# Altium schematic sheet Psoc-robot.SchDoc
size A4; SheetNumber: 4
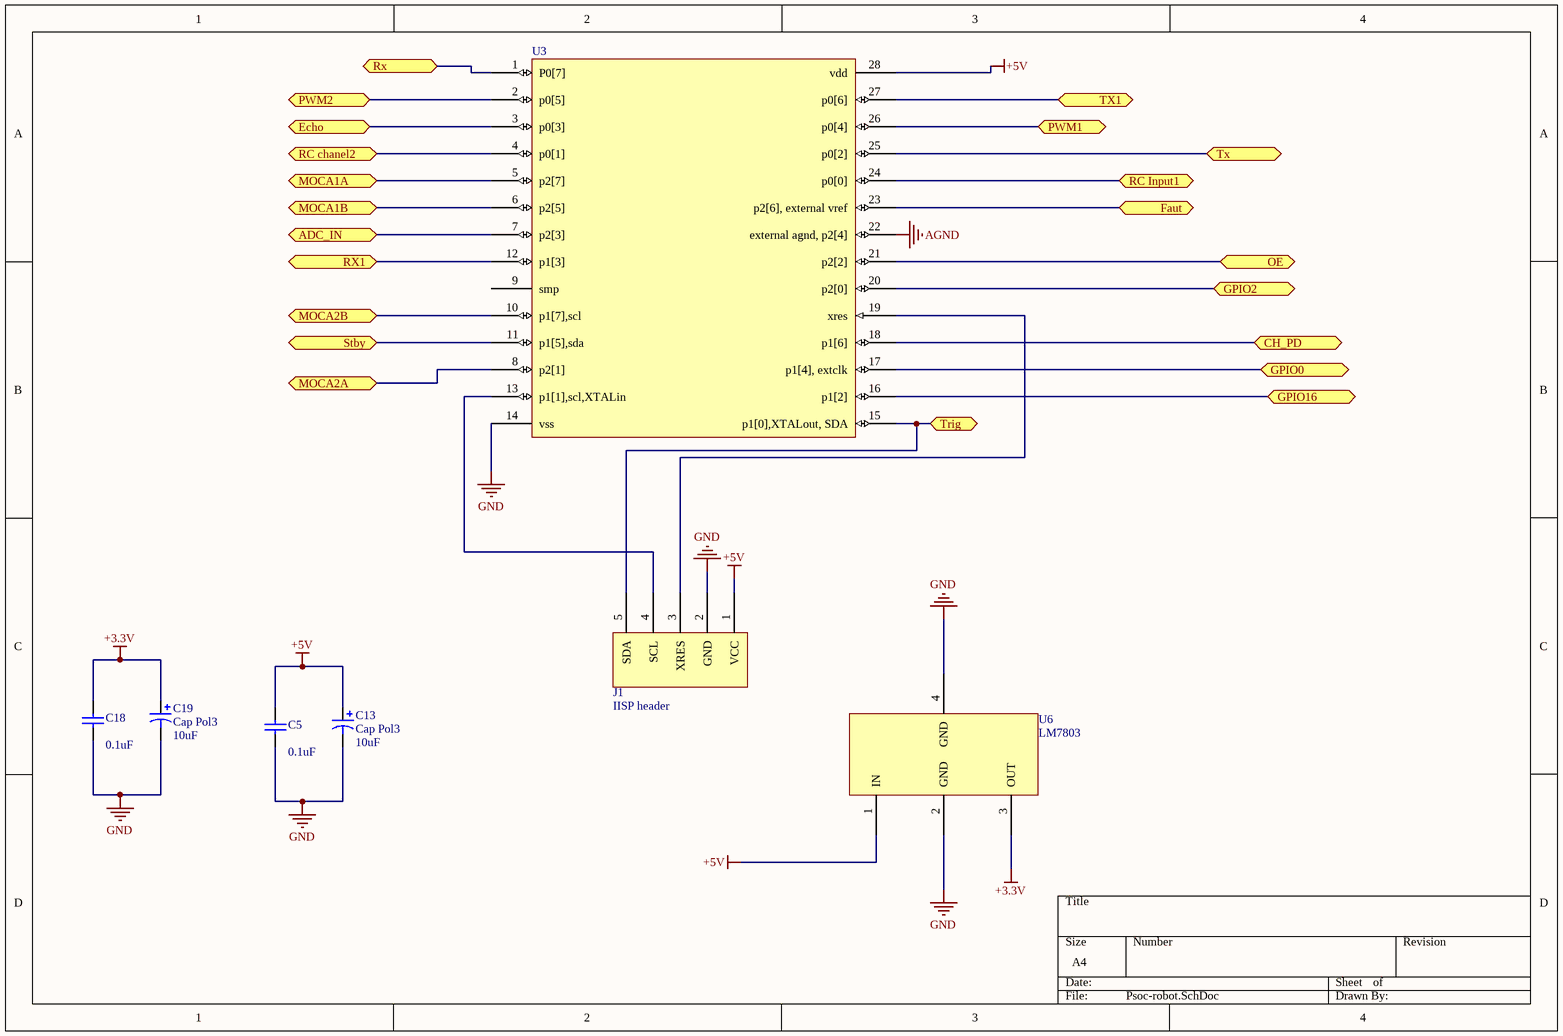
[diagram p0: Psoc-robot.SchDoc]

## Parts
C5  value 0.1uF  [C1206]  (hidden comment: Cap Semi)
C13  Cap Pol3  value 10uF  [C0805]
C18  value 0.1uF  [C1206]  (hidden comment: Cap Semi)
C19  Cap Pol3  value 10uF  [C0805]
J1  IISP header  [Programm header]
U3  Component_1  [CY8C29466]  (value not drawn)
U6  LM7803  [LM7805]

## Ports
ADC_IN, CH_PD, Echo, Faut, GPIO0, GPIO2, GPIO16, MOCA1A, MOCA1B, MOCA2A, MOCA2B, OE, PWM1, PWM2, RC chanel2, RC Input1, Rx, RX1, Stby, Trig, Tx, TX1

## Nets
+3.3V: C18.1 C19.1 U6.3(OUT)
+5V: C5.1 C13.1 J1.1(VCC) U3.28(vdd) U6.1(IN)
AGND: U3.22(external_agnd,_p2[4])
GND: C5.2 C13.2 C18.2 C19.2 J1.2(GND) U3.14(vss) U6.2(GND) U6.4(GND)
ADC_IN: U3.7(p2[3]) ; port ADC_IN
CH_PD: U3.18(p1[6]) ; port CH_PD
Echo: U3.3(p0[3]) ; port Echo
Faut: U3.23(p2[6],_external_vref) ; port Faut
GPIO0: U3.17(p1[4],_extclk) ; port GPIO0
GPIO2: U3.20(p2[0]) ; port GPIO2
GPIO16: U3.16(p1[2]) ; port GPIO16
MOCA1A: U3.5(p2[7]) ; port MOCA1A
MOCA1B: U3.6(p2[5]) ; port MOCA1B
MOCA2A: U3.8(p2[1]) ; port MOCA2A
MOCA2B: U3.10(p1[7],scl) ; port MOCA2B
OE: U3.21(p2[2]) ; port OE
PWM1: U3.26(p0[4]) ; port PWM1
PWM2: U3.2(p0[5]) ; port PWM2
RC chanel2: U3.4(p0[1]) ; port RC chanel2
RC Input1: U3.24(p0[0]) ; port RC Input1
Rx: U3.1(P0[7]) ; port Rx
RX1: U3.12(p1[3]) ; port RX1
Stby: U3.11(p1[5],sda) ; port Stby
Trig: J1.5(SDA) U3.15(p1[0],XTALout,_SDA) ; port Trig
Tx: U3.25(p0[2]) ; port Tx
TX1: U3.27(p0[6]) ; port TX1
NetJ1_3: J1.3(XRES) U3.19(xres)
NetJ1_4: J1.4(SCL) U3.13(p1[1],scl,XTALin)

Not connected (* = marked no-connect by the designer): U3 9(smp)

## Library data of the parts
C5 C18 = Cap Semi: Capacitor (Semiconductor SIM Model); Published: 8-Jun-2000; LatestRevisionDate: 29-May-2009; LatestRevisionNote: IPC-7351 Footprint Added.; PackageReference: C1206; Publisher: Altium Limited; PackageDescription: Chip Capacitor
C13 C19 = Cap Pol3: Polarized Capacitor (Surface Mount); Published: 8-Jun-2000; LatestRevisionDate: 29-May-2009; LatestRevisionNote: IPC-7351 Footprint Added.; PackageReference: C0805; Publisher: Altium Limited; PackageDescription: Chip Capacitor